# Altium schematic sheet Communication.SchDoc
size A4
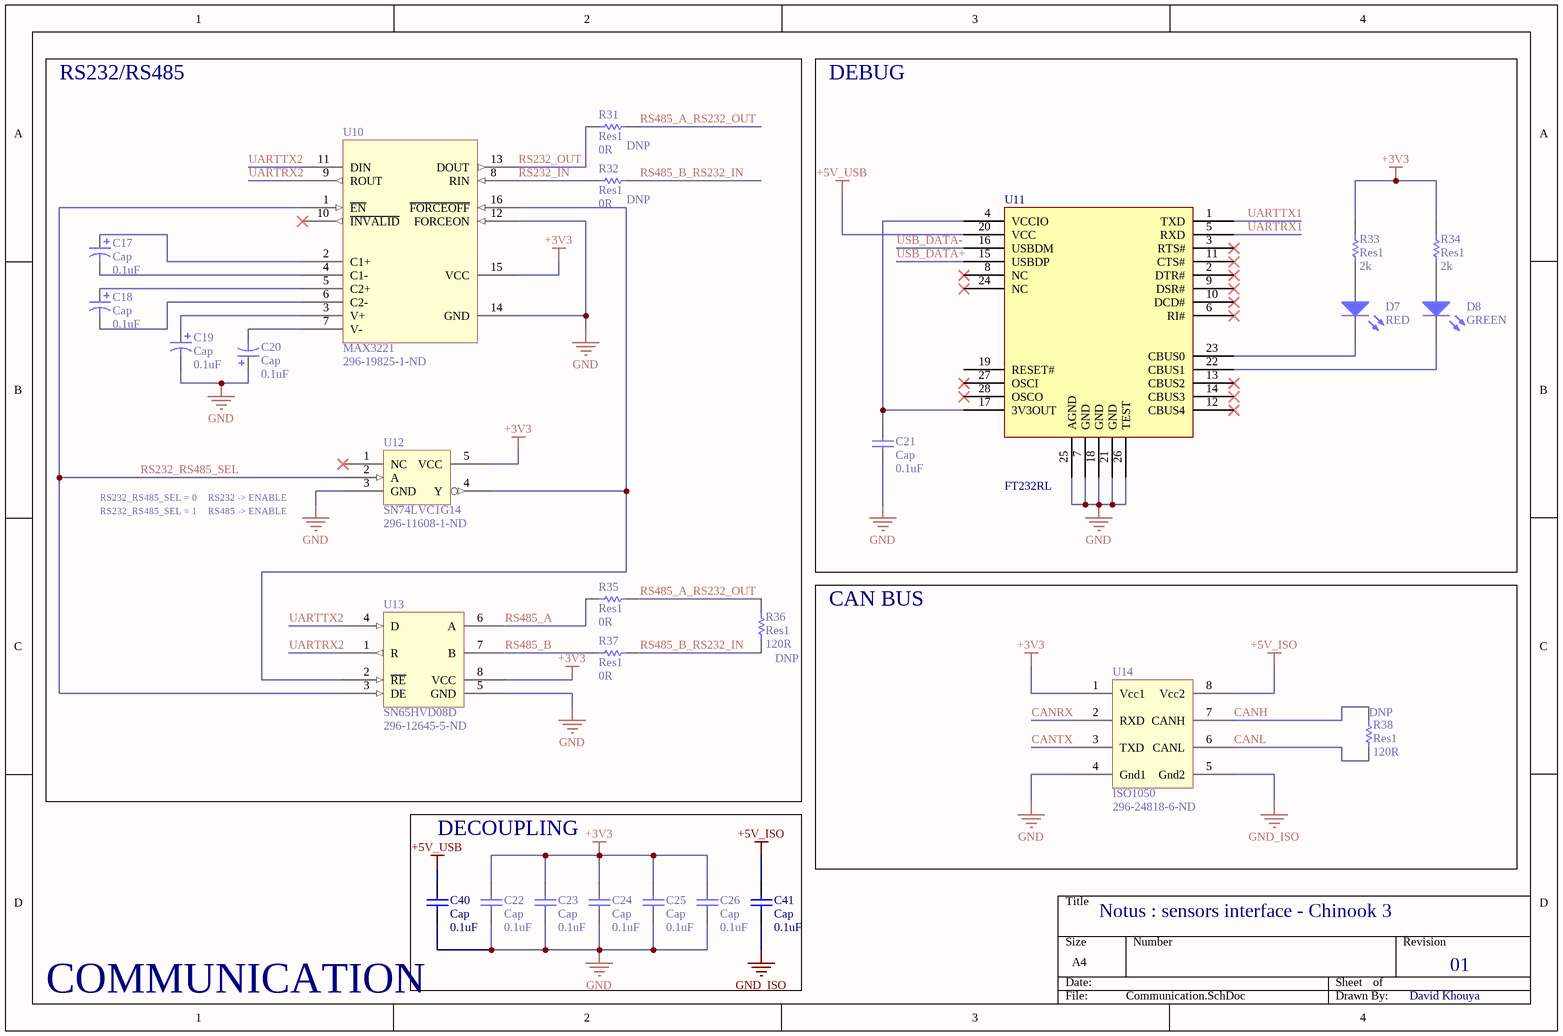
[diagram p0: Communication.SchDoc]

## Parts
C17  Cap  value 0.1uF  [C0805]
C18  Cap  value 0.1uF  [C0805]
C19  Cap  value 0.1uF  [C0805]
C20  Cap  value 0.1uF  [C0805]
C21  Cap  value 0.1uF  [RESC2012N]
C22  Cap  value 0.1uF  [RESC2012N]
C23  Cap  value 0.1uF  [RESC2012N]
C24  Cap  value 0.1uF  [RESC2012N]
C25  Cap  value 0.1uF  [RESC2012N]
C26  Cap  value 0.1uF  [RESC2012N]
C40  Cap  value 0.1uF  [RESC2012N]
C41  Cap  value 0.1uF  [RESC2012N]
D7  RED  [0805_Diode]
D8  GREEN  [0805_Diode]
R31  Res1  value 0R  [RESC2012N]
R32  Res1  value 0R  [RESC2012N]
R33  Res1  value 2k  [RESC2012N]
R34  Res1  value 2k  [RESC2012N]
R35  Res1  value 0R  [RESC2012N]
R36  Res1  value 120R  [RESC2012N]
R37  Res1  value 0R  [RESC2012N]
R38  Res1  value 120R  [RESC2012N]
U10  MAX3221  Supplier Part Number 1: 296-19825-1-ND  [SSOP16_M]
U11  FT232RL  [ssop-28]
U12  SN74LVC1G14  Supplier Part Number 1: 296-11608-1-ND  [SOT23-5AM]
U13  SN65HVD08D  Supplier Part Number 1: 296-12645-5-ND  [8SOIC-2]
U14  ISO1050  Supplier Part Number 1: 296-24818-6-ND  [SOP-8]

## Blocks framed on the sheet
RS232/RS485: C17-C20 R31 R32 R35-R37 U10 U12 U13
DEBUG: C21 D7 D8 R33 R34 U11
CAN BUS: R38 U14
DECOUPLING: C22-C26 C40 C41

## Nets
+3V3: C22.2 C23.2 C24.2 C25.2 C26.2 R33.1 R34.1 U10.15(VCC) U12.5(VCC) U13.8(VCC) U14.1(Vcc1)
+5V_ISO: C41.2 U14.8(Vcc2)
+5V_USB: C40.2 U11.20(VCC)
GND: C19.2 C20.1 C21.1 C22.1 C23.1 C24.1 C25.1 C26.1 C40.1 U10.12(FORCEON) U10.14(GND) U11.7(GND) U11.18(GND) U11.21(GND) U11.25(AGND) U11.26(TEST) U12.3(GND) U13.5(GND) U14.4(Gnd1)
GND_ISO: C41.1 U14.5(Gnd2)
CANH: R38.1 U14.7(CANH)
CANL: R38.2 U14.6(CANL)
CANRX: U14.2(RXD)
CANTX: U14.3(TXD)
RS232_IN: R32.1 U10.8(RIN)
RS232_OUT: R31.1 U10.13(DOUT)
RS232_RS485_SEL: U10.1(~{EN}) U12.2(A) U13.3(DE)
RS485_A: R35.1 U13.6(A)
RS485_A_RS232_OUT: R31.2 R35.2 R36.2
RS485_B: R37.1 U13.7(B)
RS485_B_RS232_IN: R32.2 R36.1 R37.2
UARTRX1: U11.5(RXD)
UARTRX2: U10.9(ROUT) U13.1(R)
UARTTX1: U11.1(TXD)
UARTTX2: U10.11(DIN) U13.4(D)
USB_DATA+: U11.15(USBDP)
USB_DATA-: U11.16(USBDM)
NetC17_1: C17.1 U10.2(C1+)
NetC17_2: C17.2 U10.4(C1-)
NetC18_1: C18.1 U10.5(C2+)
NetC18_2: C18.2 U10.6(C2-)
NetC19_1: C19.1 U10.3(V+)
NetC20_2: C20.2 U10.7(V-)
NetC21_2: C21.2 U11.4(VCCIO) U11.17(3V3OUT)
NetD7_1: D7.1(A) R33.2
NetD7_2: D7.2(K) U11.23(CBUS0)
NetD8_1: D8.1(A) R34.2
NetD8_2: D8.2(K) U11.22(CBUS1)
NetU10_16: U10.16(~{FORCEOFF}) U12.4(Y) U13.2(~{RE})

Not connected (* = marked no-connect by the designer): U10 10(~{INVALID})*; U11 2(DTR#)* 3(RTS#)* 6(RI#)* 8(NC)* 9(DSR#)* 10(DCD#)* 11(CTS#)* 12(CBUS4)* 13(CBUS2)* 14(CBUS3)* 19(RESET#) 24(NC)* 27(OSCI)* 28(OSCO)*; U12 1(NC)*

## Notes on the sheet
- RS232_RS485_SEL = 0
- RS232_RS485_SEL = 1
- RS232 -> ENABLE
- RS485 -> ENABLE
- Notus : sensors interface - Chinook 3
- 01
- COMMUNICATION
- David Khouya

## Library data of the parts
C17-C20 = Cap Pol3: Polarized Capacitor (Surface Mount); Published: 8-Jun-2000; LatestRevisionDate: 29-May-2009; LatestRevisionNote: IPC-7351 Footprint Added.; PackageReference: C0805; Publisher: Altium Limited; PackageDescription: Chip Capacitor
C21-C26 C40 C41 = Cap: Capacitor; Published: 8-Jun-2000; LatestRevisionDate: 17-Jul-2002; LatestRevisionNote: Re-released for DXP Platform.; PackageReference: RAD-0.3; Publisher: Altium Limited; PackageDescription: Radial Cap, Thru-Hole; 2 Leads; 0.3 in Pin Spacing
D7 D8 = LED0: Typical INFRARED GaAs LED; Published: 8-Jun-2000; LatestRevisionDate: 08-Jul-2005; LatestRevisionNote: Mech Layer 1 removed.; PackageReference: LED-0; Publisher: Altium Limited; PackageDescription: LED; 2 Leads
R31-R38 = Res1: Resistor; Published: 8-Jun-2000; LatestRevisionDate: 17-Jul-2002; LatestRevisionNote: Re-released for DXP Platform.; PackageReference: AXIAL-0.3; Publisher: Altium Limited; PackageDescription: Axial Device, Thru-Hole; 2 Leads; 0.3 in Pin Spacing
  R31 R32 R36 R38: DNP: DNP
U10 = MAX3221: RS232 to TTL; Supplier 1: Digi-Key
U11 = FT232RL: USB UART IC
U12 = SN74LVC1G14: Inverter Gate; Supplier 1: Digi-Key
U13 = SN65HVD08D: RS485 to TTL; Supplier 1: Digi-Key
U14 = ISO1050: ISOLATED CAN TRANSCEIVER; Supplier 1: Digi-Key